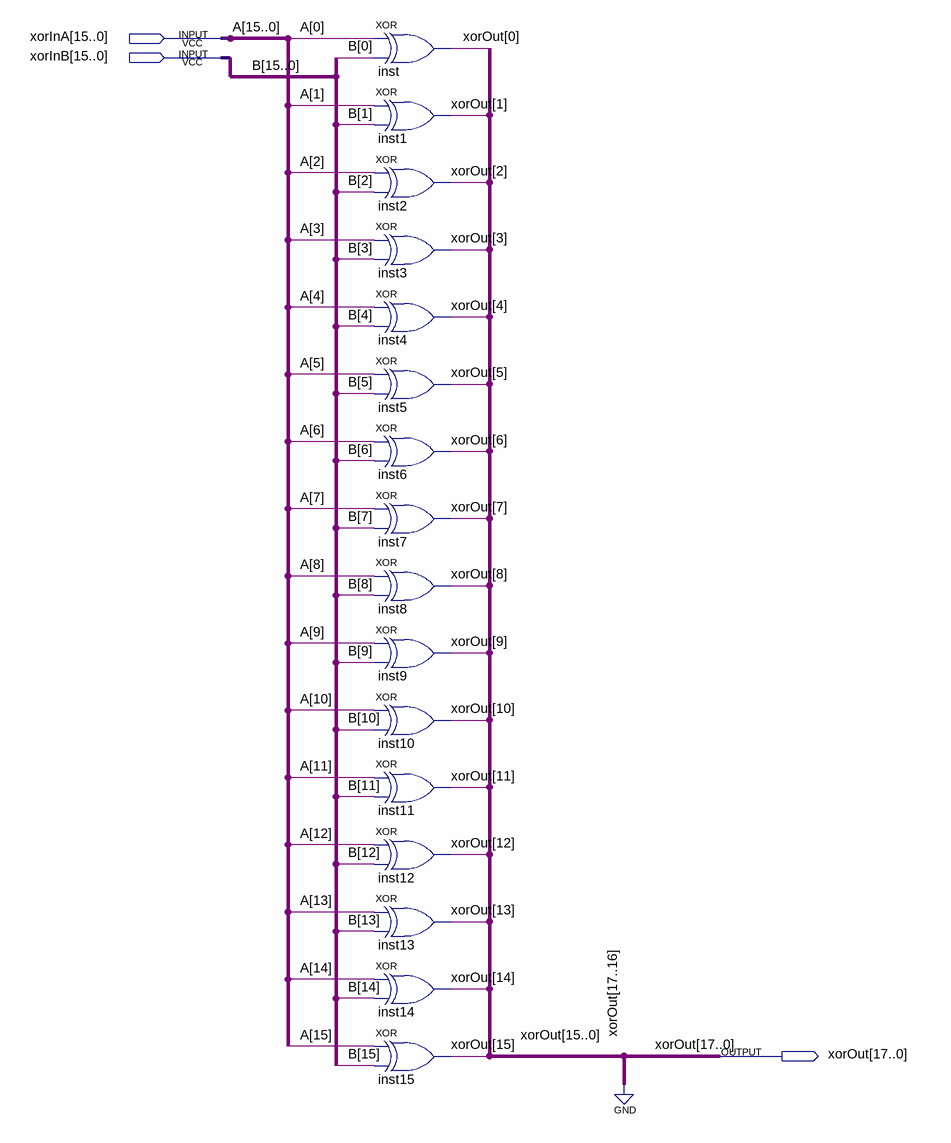
[diagram p0: schematic sheet]
// Quartus schematic xor1616.bdf as structural Verilog: 16 symbols, 3 pins
module xor1616 (
  input  [15:0] xorInA,
  input  [15:0] xorInB,
  output [17:0] xorOut
);

  xor inst (xorOut[0], xorInA[0], xorInB[0]);
  xor inst1 (xorOut[1], xorInA[1], xorInB[1]);
  xor inst2 (xorOut[2], xorInA[2], xorInB[2]);
  xor inst3 (xorOut[3], xorInA[3], xorInB[3]);
  xor inst4 (xorOut[4], xorInA[4], xorInB[4]);
  xor inst5 (xorOut[5], xorInA[5], xorInB[5]);
  xor inst6 (xorOut[6], xorInA[6], xorInB[6]);
  xor inst7 (xorOut[7], xorInA[7], xorInB[7]);
  xor inst8 (xorOut[8], xorInA[8], xorInB[8]);
  xor inst9 (xorOut[9], xorInA[9], xorInB[9]);
  xor inst10 (xorOut[10], xorInA[10], xorInB[10]);
  xor inst11 (xorOut[11], xorInA[11], xorInB[11]);
  xor inst12 (xorOut[12], xorInA[12], xorInB[12]);
  xor inst13 (xorOut[13], xorInA[13], xorInB[13]);
  xor inst14 (xorOut[14], xorInA[14], xorInB[14]);
  xor inst15 (xorOut[15], xorInA[15], xorInB[15]);

  assign xorOut[17:16] = 2'b00;

  // Other names for the same wires on the sheet: A[15:0] = xorInA; B[15:0] = xorInB
endmodule
